# Altium schematic sheet crw_power.SchDoc
size A
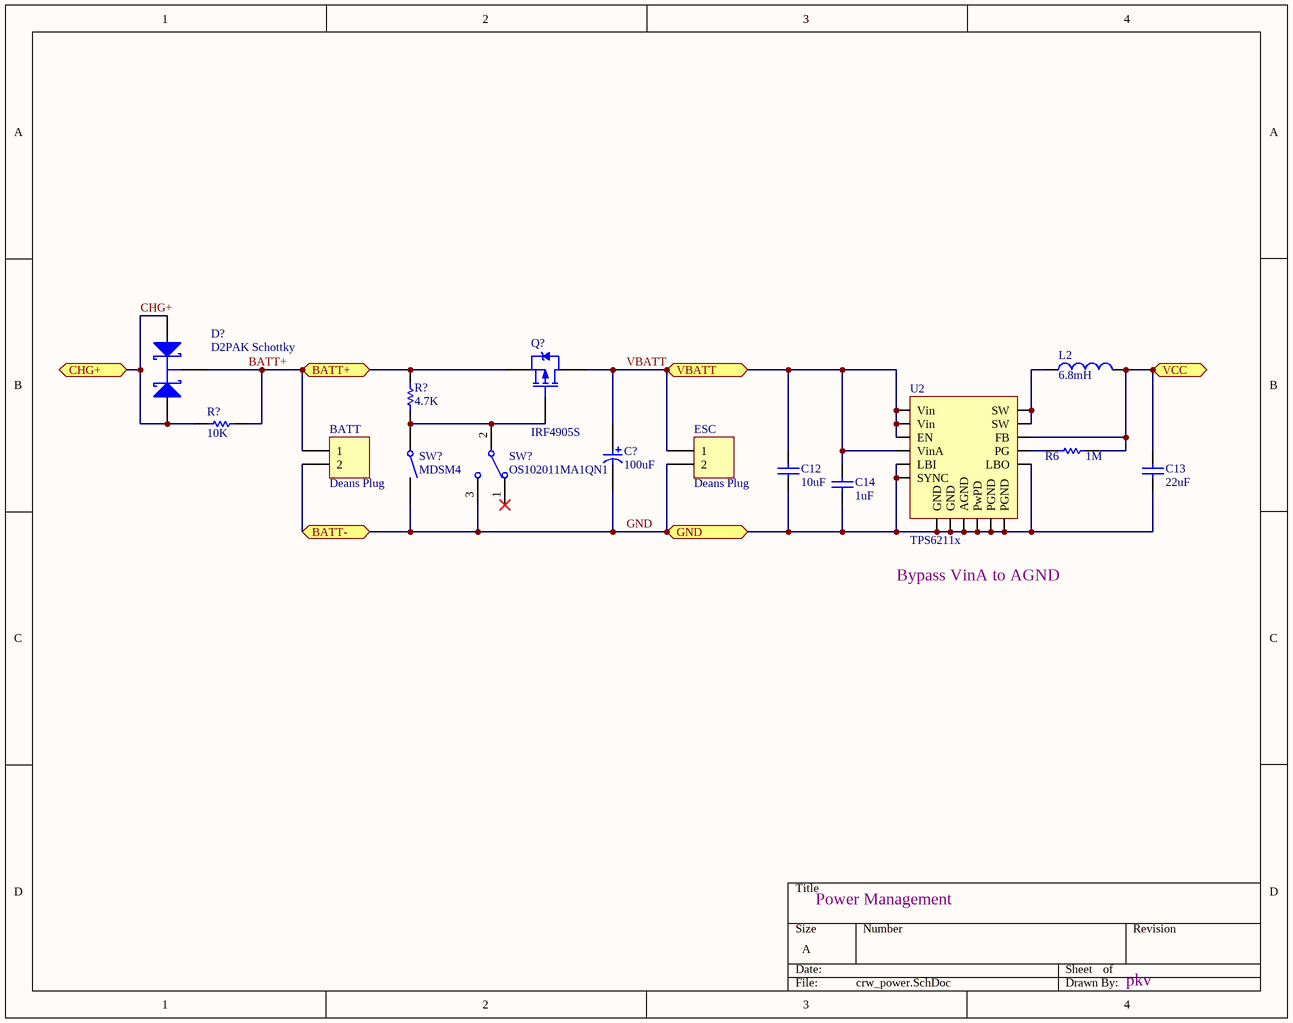
[diagram p0: crw_power.SchDoc]

## Parts
(Parts that share a designator on the sheet are numbered #1, #2 ... from top to bottom, then left to right.)
BATT  Deans Plug
C12  value 10uF  [C1206]  (hidden comment: Cap Semi)
C13  value 22uF  [C1206]  (hidden comment: Cap Semi)
C14  value 1uF  [C1206]  (hidden comment: Cap Semi)
C?  value 100uF  [WX Series Capacitor (6.3mm Body)]  (hidden comment: Cap Pol)
D?  D2PAK Schottky  [D2PAK]
ESC  Deans Plug
L2  value 6.8mH  [3261]  (hidden comment: Inductor)
Q?  IRF4905S  [D2PAK]
R6  value 1M  [3216[1206]]  (hidden comment: Res Semi)
R?#1  value 4.7K  [2012[0805]]  (hidden comment: Res Semi)
R?#2  value 10K  [2012[0805]]  (hidden comment: Res Semi)
SW?#1  MDSM4  [MDSM4]
SW?#2  OS102011MA1QN1  [OS102011MA1QN1]
U2  TPS6211x  [QFN65P400X400X80-16N]

## Ports
BATT+, BATT-, CHG+, GND, VBATT, VCC

## Nets
BATT+: BATT.1 D?.2(K) Q?.3(S) R?#1.1 R?#2.1 ; port BATT+
CHG+: D?.1(A1) D?.3(A2) R?#2.2 ; port CHG+
GND: BATT.2 C12.1 C13.1 C14.1 C?.2 ESC.2 SW?#1.2 SW?#2.3 U2.1(PGND) U2.5(SYNC) U2.6(LBO) U2.7(LBI) U2.9(AGND) U2.11(GND) U2.12(GND) U2.16(PGND) U2.PAD(PwPD) ; port BATT-, port GND
VBATT: C12.2 C14.2 C?.1 ESC.1 Q?.2(D) U2.2(Vin) U2.3(Vin) U2.4(EN) U2.8(VinA) ; port VBATT
VCC: C13.2 L2.2 R6.2 U2.10(FB) ; port VCC
NetL2_1: L2.1 U2.14(SW) U2.15(SW)
NetQ?_1: Q?.1(G) R?#1.2 SW?#1.1 SW?#2.2
NetR6_1: R6.1 U2.13(PG)

Not connected (* = marked no-connect by the designer): SW?#2 1*

## Notes on the sheet
- (near U2) Bypass VinA to AGND
- Power Management
- pkv

## Library data of the parts
BATT ESC = DeansUltraPlug2P: Deans 2-pin Ultra Plug
C12-C14 = Cap Semi: Capacitor (Semiconductor SIM Model); Published: 8-Jun-2000; LatestRevisionDate: 17-Jul-2002; LatestRevisionNote: Re-released for DXP Platform.; PackageReference: C1206; Publisher: Altium Limited
C? = Cap Pol: Polarized Capacitor
D? = 10CTQ150S: Schottky Rectifier; Note: Terminal 2 is the TAB and is electrically connected to the cathode; Published: 8-Jun-2000; LatestRevisionDate: 17-Jul-2002; LatestRevisionNote: Re-released for DXP Platform.; DatasheetDocument: Apr-1999; PackageReference: D2PAK; Publisher: Altium Limited; ComponentLink1Description: Manufacturer Link; ComponentLink1URL: http://www.irf.com/; ComponentLink2Description: Datasheet; ComponentLink2URL: http://www.irf.com/product-info/datasheets/data/10ctq150.pdf
L2 = Inductor: Code_IEC: 1005; Published: 8-Jun-2000; LatestRevisionDate: 17-Jul-2002; LatestRevisionNote: Re-released for DXP Platform.; PackageReference: 0402-A; Publisher: Altium Limited; Code_JEITA: 0402
Q? = IRF4905S: HEXFET Power MOSFET; Published: 8-Jun-2000; LatestRevisionDate: 17-Jul-2002; LatestRevisionNote: Re-released for DXP Platform.; DatasheetVersion: Aug-1997; PackageReference: D2PAK; Publisher: Altium Limited; PackageDescription: D2-PAK/TO-263-AB; 3 Leads (1 Cropped); Body 15.5 (inc. leads) x 10.5 mm (LxW max); ComponentLink1Description: Manufacturer Link; ComponentLink1URL: http://www.irf.com/; ComponentLink2Description: Datasheet; ComponentLink2URL: http://www.irf.com/product-info/datasheets/data/irf4905s.pdf
R6 R?#1 R?#2 = Res Semi: Semiconductor Resistor; Published: 8-Jun-2000; LatestRevisionDate: 17-Jul-2002; LatestRevisionNote: Re-released for DXP Platform.; PackageReference: AXIAL-0.5; Publisher: Altium Limited
SW?#1 = MDSM4: SMT Reed Switch
SW?#2 = OS102011MA1QN1: Miniature SPDT Slide Switch